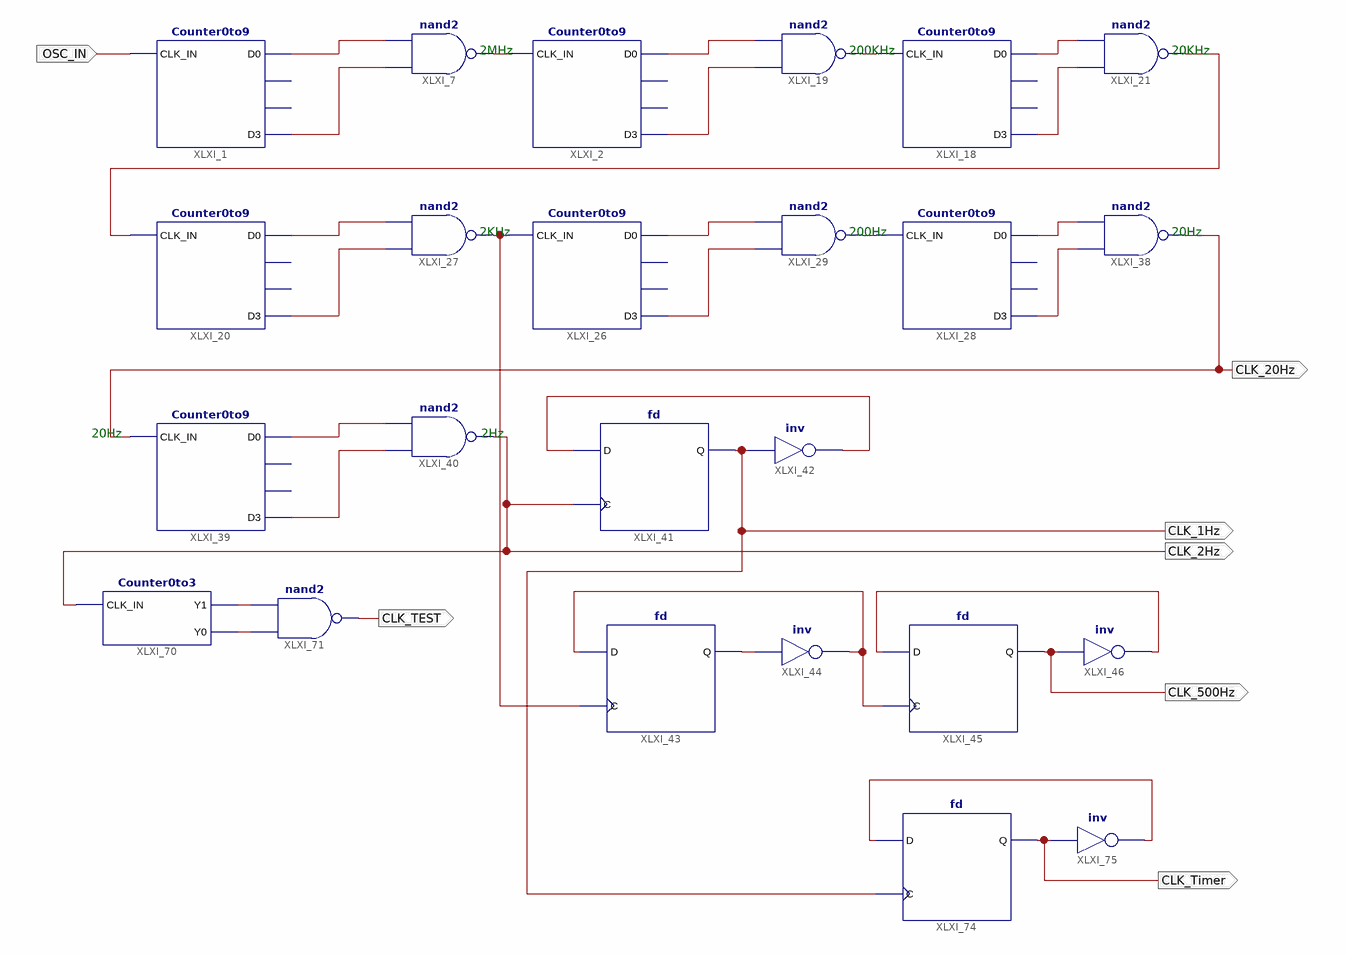
[diagram p0: schematic sheet 1]
// Xilinx ISE schematic Clock_Divider.sch (spartan6) as structural Verilog: 24 symbols, 7 ports
module Clock_Divider (
  input  OSC_IN,
  output CLK_20Hz,
  output CLK_1Hz,
  output CLK_2Hz,
  output CLK_500Hz,
  output CLK_TEST,
  output CLK_Timer
);

  wire XLXN_2, XLXN_5, XLXN_10, XLXN_15, XLXN_16, XLXN_17, XLXN_18, XLXN_19, XLXN_20, XLXN_21, XLXN_22,
       XLXN_23, XLXN_24, XLXN_26, XLXN_27, XLXN_28, XLXN_36, XLXN_37, XLXN_39, XLXN_43, XLXN_45, XLXN_47,
       XLXN_49, XLXN_88, XLXN_89, XLXN_94;

  Counter0to9 XLXI_1 (.CLK_IN(OSC_IN), .D0(XLXN_15), .D3(XLXN_16));  // open: D1, D2
  Counter0to9 XLXI_20 (.CLK_IN(XLXN_26), .D0(XLXN_19), .D3(XLXN_20));  // open: D1, D2
  nand XLXI_21 (XLXN_26, XLXN_24, XLXN_23);
  Counter0to9 XLXI_2 (.CLK_IN(XLXN_2), .D0(XLXN_17), .D3(XLXN_18));  // open: D1, D2
  nand XLXI_7 (XLXN_2, XLXN_16, XLXN_15);
  Counter0to9 XLXI_18 (.CLK_IN(XLXN_5), .D0(XLXN_23), .D3(XLXN_24));  // open: D1, D2
  nand XLXI_19 (XLXN_5, XLXN_18, XLXN_17);
  Counter0to9 XLXI_26 (.CLK_IN(XLXN_49), .D0(XLXN_21), .D3(XLXN_22));  // open: D1, D2
  nand XLXI_27 (XLXN_49, XLXN_20, XLXN_19);
  Counter0to9 XLXI_28 (.CLK_IN(XLXN_10), .D0(XLXN_27), .D3(XLXN_28));  // open: D1, D2
  nand XLXI_29 (XLXN_10, XLXN_22, XLXN_21);
  nand XLXI_38 (CLK_20Hz, XLXN_28, XLXN_27);
  Counter0to9 XLXI_39 (.CLK_IN(CLK_20Hz), .D0(XLXN_36), .D3(XLXN_37));  // open: D1, D2
  nand XLXI_40 (CLK_2Hz, XLXN_37, XLXN_36);
  fd XLXI_41 (.C(CLK_2Hz), .D(XLXN_39), .Q(CLK_1Hz));
  not XLXI_42 (XLXN_39, CLK_1Hz);
  fd XLXI_43 (.C(XLXN_49), .D(XLXN_47), .Q(XLXN_43));
  not XLXI_44 (XLXN_47, XLXN_43);
  fd XLXI_45 (.C(XLXN_47), .D(XLXN_45), .Q(CLK_500Hz));
  not XLXI_46 (XLXN_45, CLK_500Hz);
  nand XLXI_71 (CLK_TEST, XLXN_89, XLXN_88);
  Counter0to3 XLXI_70 (.CLK_IN(CLK_2Hz), .Y1(XLXN_88), .Y0(XLXN_89));
  fd XLXI_74 (.C(CLK_1Hz), .D(XLXN_94), .Q(CLK_Timer));
  not XLXI_75 (XLXN_94, CLK_Timer);

  // Notes on the sheet:
  //   2MHz
  //   200KHz
  //   20KHz
  //   2KHz
  //   200Hz
  //   20Hz
  //   20Hz
  //   2Hz
endmodule
